# EAGLE schematic Power Dist (EAGLE 7.6.0)
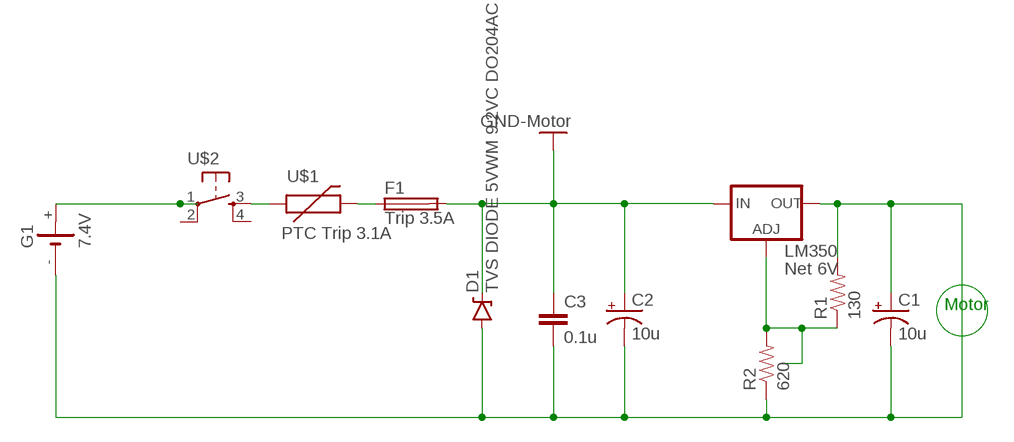
[diagram p0: schematic, sheet 1]

## Parts
C1  10u  CAP_POLPTH2  [CPOL-RADIAL-10UF-25V]
C2  10u  CAP_POLPTH2  [CPOL-RADIAL-10UF-25V]
C3  0.1u  0.1UF-50V-20%(PTH)KIT-EZ  [CAP-PTH-SMALL-KIT]
D1  TVS DIODE 5VWM 9.2VC DO204AC  DIODE-ZENER  [DIODE-BZT52]
F1  Trip 3.5A  19559  [19559]
G1  7.4V  SL-340/P3.6V  [SL-340/P3.6V]
LM350  Net 6V  V_REG_317DPACK  [V-REG_DPACK]
R1  130  RESISTORPTH-1/2W  [AXIAL-0.5]
R2  620  RESISTORPTH-1/2W  [AXIAL-0.5]
U$1  PTC Trip 3.1A  PTC  [MC331XX]
U$2  TACTILE-SWITCH-7914G  [7914G]

## Nets
GND: C2.1(+) C3.1 D1.C F1.2 LM350.3(IN) ; supply symbol labelled GND-Motor
N$2: G1.+ U$2.1
N$3: U$1.P$1 U$2.3
N$4: LM350.1(ADJ) R1.P$1 R2.P$2
N$5: F1.1 U$1.P$2
N$8: C1.1(+) C1.2(-) C2.2(-) C3.2 D1.A G1.- LM350.4(OUT) R1.P$2 R2.P$1
Unconnected: U$2.2 U$2.4

## Notes on the sheet
- Motor

## Library data of the parts
C1 C2 = SparkFun-Capacitors:CAP_POL: Capacitor Polarized These are standard SMD and PTH capacitors. Normally 10uF, 47uF, and 100uF in electrolytic and tantalum varieties. Always verify the external diameter of the through hole cap, it varies with capacity, voltage, and manufacturer. The EIA devices should be standard.
C3 = SparkFun-Capacitors:0.1UF-50V-20%(PTH): CAP-08370; PROD_ID: CAP-08370
D1 = SparkFun-DiscreteSemi:DIODE-ZENER: Zener Diode Production Part - 8199 3.4V Zener Voltage; PROD-ID: DIO-08199; VALUE: BZT52
F1 = fuse:19559: FUSE HOLDER TR5, Wickmann; MPN: 55900000001; OC_FARNELL: 9516360; OC_NEWARK: 02P0286
G1 = battery:SL-340/P3.6V: LI BATTERY Sonnenschein
LM350 = SparkFun-PowerIC:V_REG_317: Voltage Regulator Standard LM317 adjustable voltage regulator. AOI (Adjust Output Input). Google 'LM317 Calculator' for easy to use app to get the two resistor values needed. 240/720 for 5V output. 240/390 for 3.3V output. Spark Fun Electronics SKU : COM-00527; PROD_ID: IC-09888
R1 R2 = SparkFun-Resistors:RESISTOR: Resistor Basic schematic elements and footprints for 0603, 1206, and PTH resistors.
U$1 = GeekAmmo:PTC: PTC Resettable Fuse
U$2 = GeekAmmo:TACTILE-SWITCH: Tactile Switch 4 Pins, SPST NO